# Altium schematic sheet BLDC-MOSFET.SchDoc
size 420 x 297 mm; ApprovedBy: Алымов; CheckedBy: Лучников; DrawnBy: Войтенко; DocumentNumber: АБВГ.000000.000 Э3; SheetNumber: 3; SheetTotal: 5; PageSetup: Record=PageOptions|CenterHorizontal=False|CenterVertical=False|PrintScale=0.95|XCorrection=0.00|YCorrection=0.00|PrintKind=1|BorderSize=5000000|LeftOffset=0|BottomOffset=0|Orientation=1|PaperLength=1000|PaperWidth=1000|Scale=100|PaperSource=15|PrintQuality=600|MediaType=1|DitherType=10|PaperKind=A4|PrintScaleMode=1; Letter1Column: Т; ProcessInspection: Близнец; NormInspection: Оськин; DocumentType: Схема электрическая принципиальная; Developer1size1str: ООО "Центр2М"; Title2size1str: Модуль питания; Title2size2str: основная плата
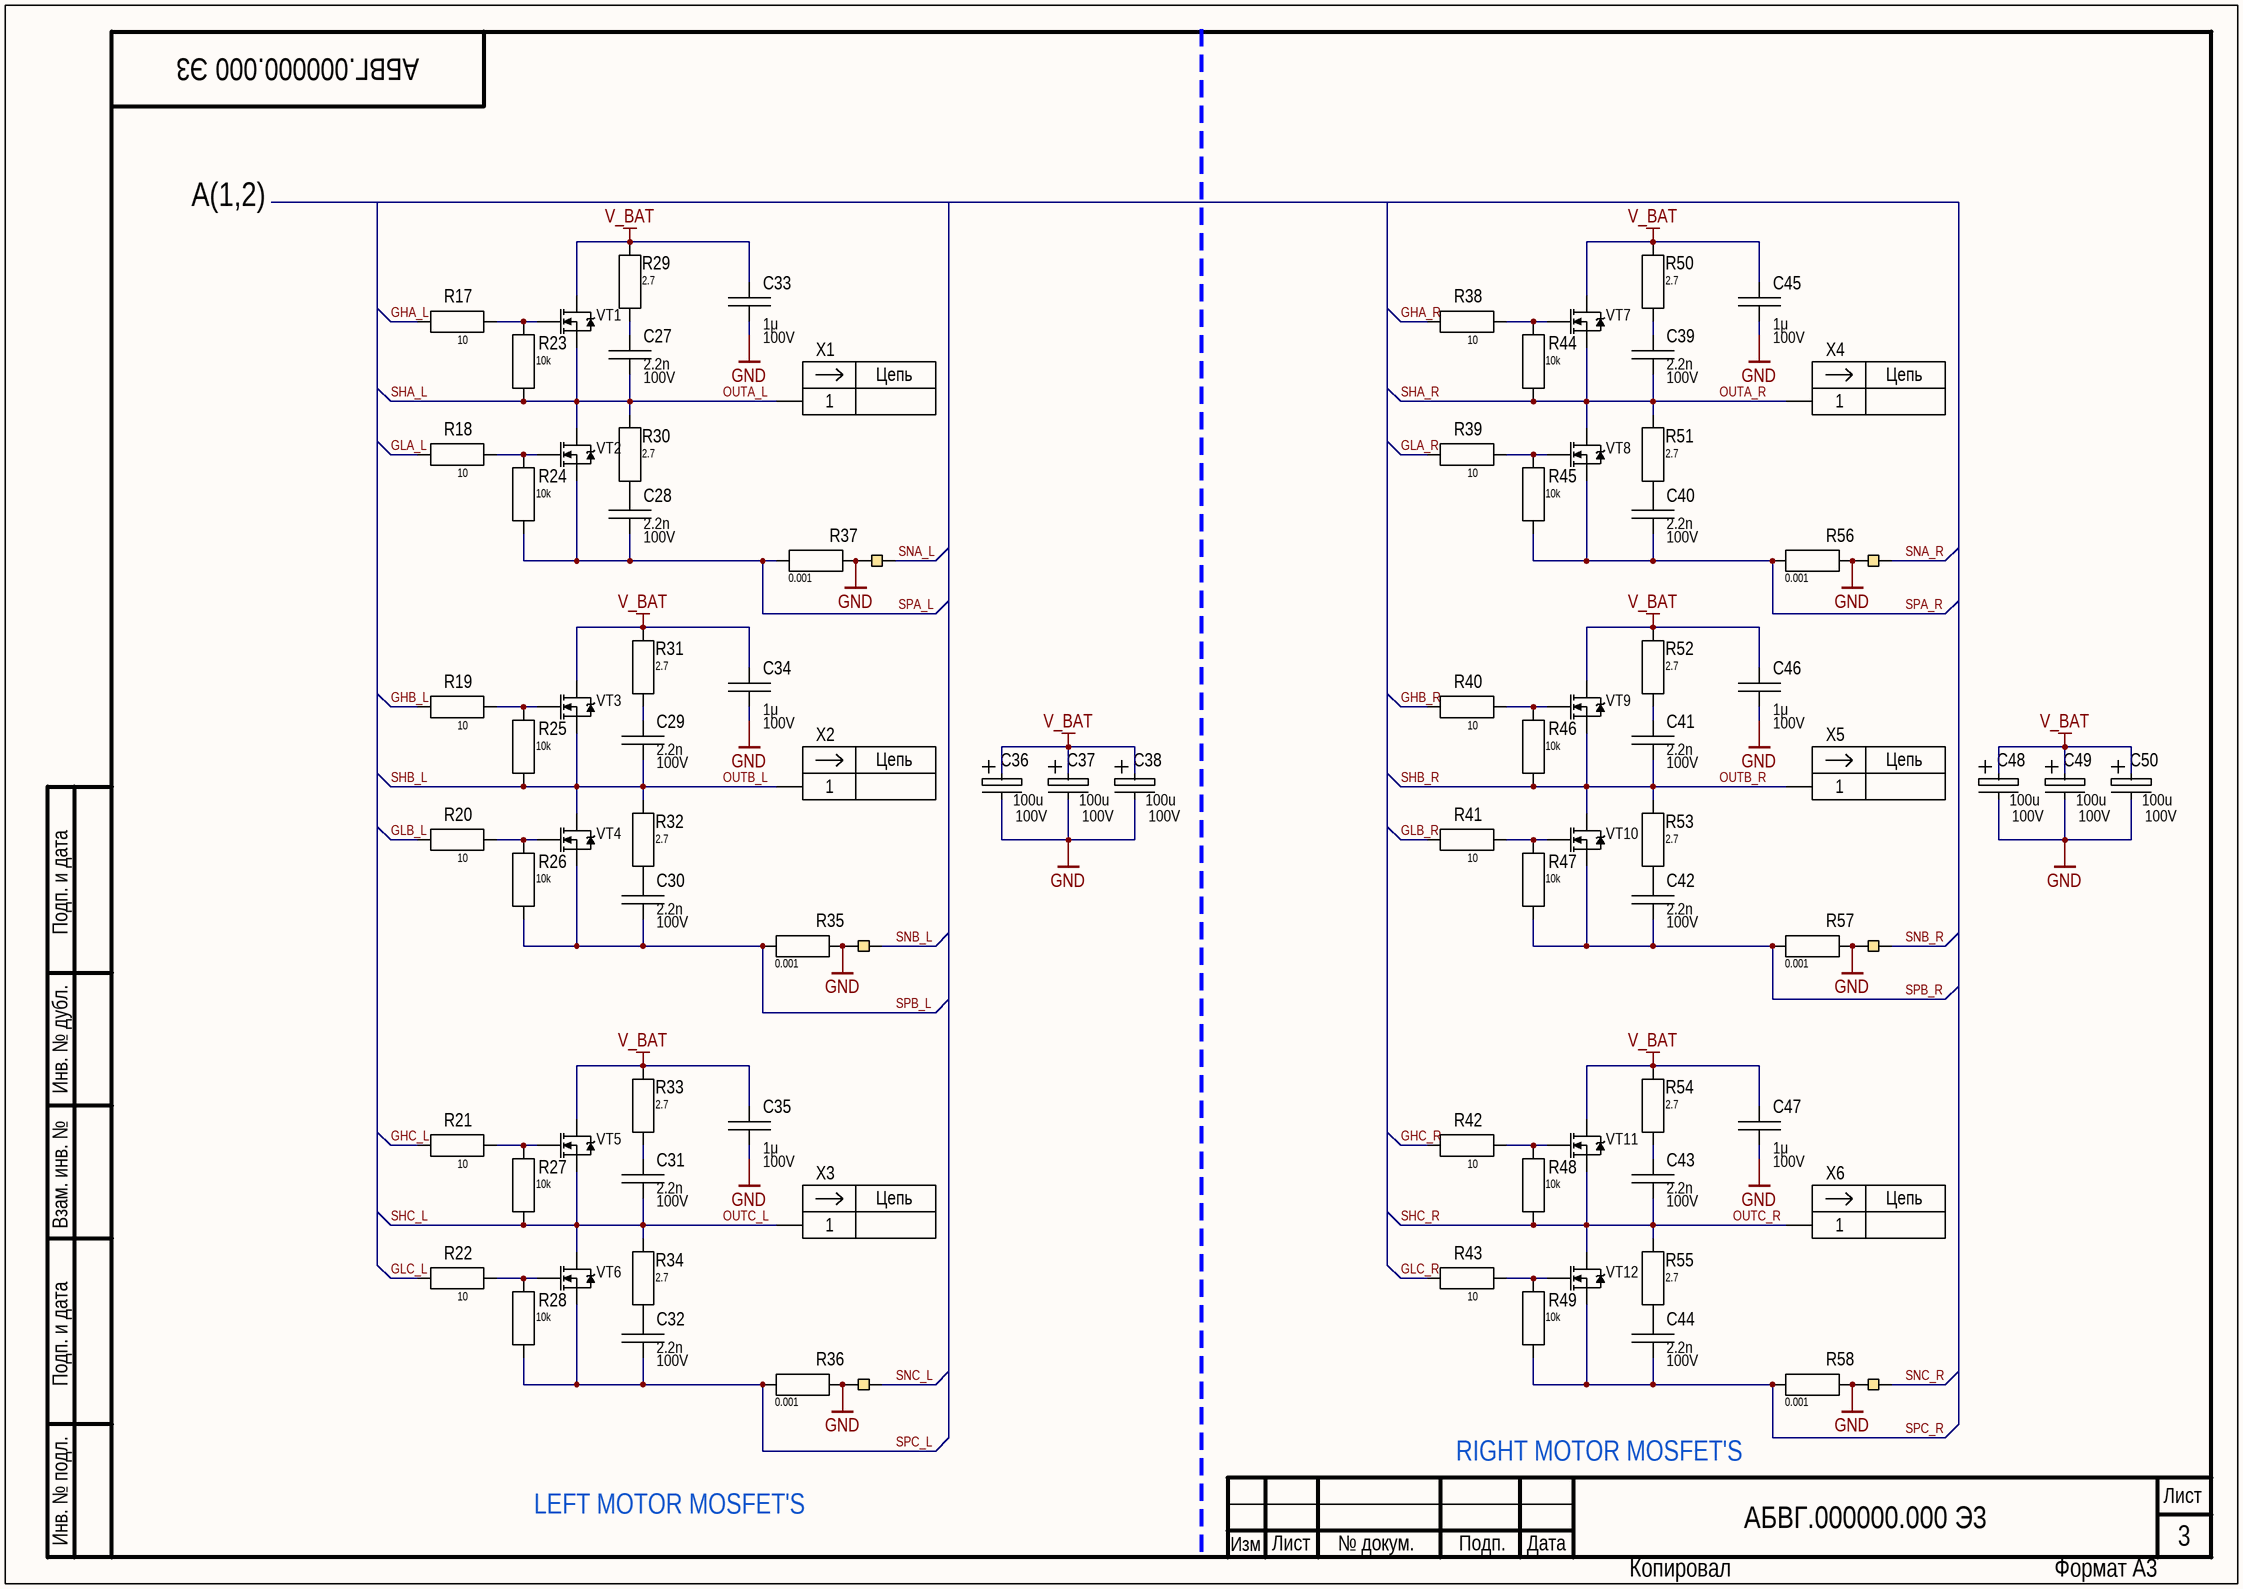
[diagram p0: BLDC-MOSFET.SchDoc]

## Parts
C27  value 2.2n  Voltage: 100V  [CAP: 0603]
C28  value 2.2n  Voltage: 100V  [CAP: 0603]
C29  value 2.2n  Voltage: 100V  [CAP: 0603]
C30  value 2.2n  Voltage: 100V  [CAP: 0603]
C31  value 2.2n  Voltage: 100V  [CAP: 0603]
C32  value 2.2n  Voltage: 100V  [CAP: 0603]
C33  value 1μ  Voltage: 100V  [CAP: 1206]
C34  value 1μ  Voltage: 100V  [CAP: 1206]
C35  value 1μ  Voltage: 100V  [CAP: 1206]
C36  Voltage: 100V  [ECR1021]  (hidden comment: 100u)
C37  Voltage: 100V  [ECR1021]  (hidden comment: 100u)
C38  Voltage: 100V  [ECR1021]  (hidden comment: 100u)
C39  value 2.2n  Voltage: 100V  [CAP: 0603]
C40  value 2.2n  Voltage: 100V  [CAP: 0603]
C41  value 2.2n  Voltage: 100V  [CAP: 0603]
C42  value 2.2n  Voltage: 100V  [CAP: 0603]
C43  value 2.2n  Voltage: 100V  [CAP: 0603]
C44  value 2.2n  Voltage: 100V  [CAP: 0603]
C45  value 1μ  Voltage: 100V  [CAP: 1206]
C46  value 1μ  Voltage: 100V  [CAP: 1206]
C47  value 1μ  Voltage: 100V  [CAP: 1206]
C48  Voltage: 100V  [ECR1021]  (hidden comment: 100u)
C49  Voltage: 100V  [ECR1021]  (hidden comment: 100u)
C50  Voltage: 100V  [ECR1021]  (hidden comment: 100u)
NT1  (no value)  [CON: NT]
NT2  (no value)  [CON: NT]
NT3  (no value)  [CON: NT]
NT4  (no value)  [CON: NT]
NT5  (no value)  [CON: NT]
NT6  (no value)  [CON: NT]
R17  10  [RES: 0402]
R18  10  [RES: 0402]
R19  10  [RES: 0402]
R20  10  [RES: 0402]
R21  10  [RES: 0402]
R22  10  [RES: 0402]
R23  10k  [RES: 0402]
R24  10k  [RES: 0402]
R25  10k  [RES: 0402]
R26  10k  [RES: 0402]
R27  10k  [RES: 0402]
R28  10k  [RES: 0402]
R29  2.7  [RES: 0805]
R30  2.7  [RES: 0805]
R31  2.7  [RES: 0805]
R32  2.7  [RES: 0805]
R33  2.7  [RES: 0805]
R34  2.7  [RES: 0805]
R35  0.001  [RES: 2512]
R36  0.001  [RES: 2512]
R37  0.001  [RES: 2512]
R38  10  [RES: 0402]
R39  10  [RES: 0402]
R40  10  [RES: 0402]
R41  10  [RES: 0402]
R42  10  [RES: 0402]
R43  10  [RES: 0402]
R44  10k  [RES: 0402]
R45  10k  [RES: 0402]
R46  10k  [RES: 0402]
R47  10k  [RES: 0402]
R48  10k  [RES: 0402]
R49  10k  [RES: 0402]
R50  2.7  [RES: 0805]
R51  2.7  [RES: 0805]
R52  2.7  [RES: 0805]
R53  2.7  [RES: 0805]
R54  2.7  [RES: 0805]
R55  2.7  [RES: 0805]
R56  0.001  [RES: 2512]
R57  0.001  [RES: 2512]
R58  0.001  [RES: 2512]
VT1  (no value)  [DirectFET MZ]
VT2  (no value)  [DirectFET MZ]
VT3  (no value)  [DirectFET MZ]
VT4  (no value)  [DirectFET MZ]
VT5  (no value)  [DirectFET MZ]
VT6  (no value)  [DirectFET MZ]
VT7  (no value)  [DirectFET MZ]
VT8  (no value)  [DirectFET MZ]
VT9  (no value)  [DirectFET MZ]
VT10  (no value)  [DirectFET MZ]
VT11  (no value)  [DirectFET MZ]
VT12  (no value)  [DirectFET MZ]
X1  DJ617-6.3 (TA-MR1)  [CON: DJ617-6.3 (TA-MR1)]  (value not drawn)
X2  DJ617-6.3 (TA-MR1)  [CON: DJ617-6.3 (TA-MR1)]  (value not drawn)
X3  DJ617-6.3 (TA-MR1)  [CON: DJ617-6.3 (TA-MR1)]  (value not drawn)
X4  DJ617-6.3 (TA-MR1)  [CON: DJ617-6.3 (TA-MR1)]  (value not drawn)
X5  DJ617-6.3 (TA-MR1)  [CON: DJ617-6.3 (TA-MR1)]  (value not drawn)
X6  DJ617-6.3 (TA-MR1)  [CON: DJ617-6.3 (TA-MR1)]  (value not drawn)

## Nets
GND: C33.1 C34.1 C35.1 C36.2 C37.2 C38.2 C45.1 C46.1 C47.1 C48.2 C49.2 C50.2 NT1.1 NT2.1 NT3.1 NT4.1 NT5.1 NT6.1 R35.1 R36.1 R37.1 R56.1 R57.1 R58.1
V_BAT: C33.2 C34.2 C35.2 C36.1 C37.1 C38.1 C45.2 C46.2 C47.2 C48.1 C49.1 C50.1 R29.2 R31.2 R33.2 R50.2 R52.2 R54.2 VT1.2(D) VT3.2(D) VT5.2(D) VT7.2(D) VT9.2(D) VT11.2(D)
GHA_L: R17.2
GHA_R: R38.2
GHB_L: R19.2
GHB_R: R40.2
GHC_L: R21.2
GHC_R: R42.2
GLA_L: R18.2
GLA_R: R39.2
GLB_L: R20.2
GLB_R: R41.2
GLC_L: R22.2
GLC_R: R43.2
OUTA_L: C27.1 R23.1 R30.2 VT1.3(S) VT2.2(D) X1.1  [also labelled SHA_L]
OUTA_R: C39.1 R44.1 R51.2 VT7.3(S) VT8.2(D) X4.1  [also labelled SHA_R]
OUTB_L: C29.1 R25.1 R32.2 VT3.3(S) VT4.2(D) X2.1  [also labelled SHB_L]
OUTB_R: C41.1 R46.1 R53.2 VT9.3(S) VT10.2(D) X5.1  [also labelled SHB_R]
OUTC_L: C31.1 R27.1 R34.2 VT5.3(S) VT6.2(D) X3.1  [also labelled SHC_L]
OUTC_R: C43.1 R48.1 R55.2 VT11.3(S) VT12.2(D) X6.1  [also labelled SHC_R]
SNA_L: NT3.2
SNA_R: NT4.2
SNB_L: NT1.2
SNB_R: NT5.2
SNC_L: NT2.2
SNC_R: NT6.2
SPA_L: C28.1 R24.1 R37.2 VT2.3(S)
SPA_R: C40.1 R45.1 R56.2 VT8.3(S)
SPB_L: C30.1 R26.1 R35.2 VT4.3(S)
SPB_R: C42.1 R47.1 R57.2 VT10.3(S)
SPC_L: C32.1 R28.1 R36.2 VT6.3(S)
SPC_R: C44.1 R49.1 R58.2 VT12.3(S)
NetC27_2: C27.2 R29.1
NetC28_2: C28.2 R30.1
NetC29_2: C29.2 R31.1
NetC30_2: C30.2 R32.1
NetC31_2: C31.2 R33.1
NetC32_2: C32.2 R34.1
NetC39_2: C39.2 R50.1
NetC40_2: C40.2 R51.1
NetC41_2: C41.2 R52.1
NetC42_2: C42.2 R53.1
NetC43_2: C43.2 R54.1
NetC44_2: C44.2 R55.1
NetR17_1: R17.1 R23.2 VT1.1(G)
NetR18_1: R18.1 R24.2 VT2.1(G)
NetR19_1: R19.1 R25.2 VT3.1(G)
NetR20_1: R20.1 R26.2 VT4.1(G)
NetR21_1: R21.1 R27.2 VT5.1(G)
NetR22_1: R22.1 R28.2 VT6.1(G)
NetR38_1: R38.1 R44.2 VT7.1(G)
NetR39_1: R39.1 R45.2 VT8.1(G)
NetR40_1: R40.1 R46.2 VT9.1(G)
NetR41_1: R41.1 R47.2 VT10.1(G)
NetR42_1: R42.1 R48.2 VT11.1(G)
NetR43_1: R43.1 R49.2 VT12.1(G)

## Notes on the sheet
- А(1,2)
- RIGHT MOTOR MOSFET'S
- LEFT MOTOR MOSFET'S
- Подп. и дата
- Инв. № дубл.
- Взам. инв. №
- Инв. № подл.
- Лист
- Изм
- № докум.
- Подп.
- Дата
- Копировал
- Формат А3
- (in symbol DJ617-6.3 (TA-MR1)) Цепь

## Library data of the parts
C27-C32 C39-C44 = Ceramic_0603: ValueManufacturerPartNumber: Ceramic capacitor, 2.2n, X7R, ±10%, 100V, 0603, -55...+125°C; TypeCapacitor: Ceramic capacitor; Tolerance: ±10%; TypeDielectric: X7R; Package: 0603; Temperature: -55...+125°C
C33-C35 C45-C47 = Ceramic_1206: ValueManufacturerPartNumber: Ceramic capacitor, 1μ, X7R, ±10%, 100V, 1206, -55...+125°C; TypeCapacitor: Ceramic capacitor; Tolerance: ±10%; TypeDielectric: X7R; Package: 1206; Temperature: -55...+125°C
C36-C38 C48-C50 = ECR1021: PartNumber: B45196HM20-35 B-100u мкФ; Value: 100u; Type: ECR1021
NT1-NT6 = NT
R17-R22 R38-R43 = RES 0402: PartNumber: RC0402FR-071KL; Tolerance: 1%; Value: 10; Manufacturer: *; Type: Resistor; Temperature_Range: *; Composition: *; Voltage: *; Case: 0402
R23-R28 R44-R49 = RES 0402: Tolerance: 1%; PartNumber: *; Value: 10k
R29-R34 R50-R55 = RES 0805: Tolerance: *; PartNumber: *; Value: 2.7
R35-R37 R56-R58 = RES 2512: PartNumber: CST0612-FC-R001E; Value: 0.001
VT1-VT12 = MOSFET_N_123: Manufacturer: Infineon Technologies; ValueManufacturerPartNumber: MOSFET N-channel transistor, 150V, 35A, 9.1nC, 2.5W, 29mOhm, 756pF, DIRECTFET-MZ, -55...+150°C; PartNumber: IRF6643TRPBF; TypeTransistor: MOSFET N-channel transistor; VoltageDS: 150V; CurrentDS: 35A; RDS: 29mOhm; GateCharge: 9.1nC; InputCapacitor: 756pF; MaxPower: 2.5W; Package: DIRECTFET-MZ; Link: https://www.chipdip.by/product/irf6643trpbf; Temperature: -55...+150°C
X1-X6 = DJ617-6.3 (TA-MR1): PartNumber: DJ617-6.3 (TA-MR1)